# EAGLE design Schematic (EAGLE 7.7.0)
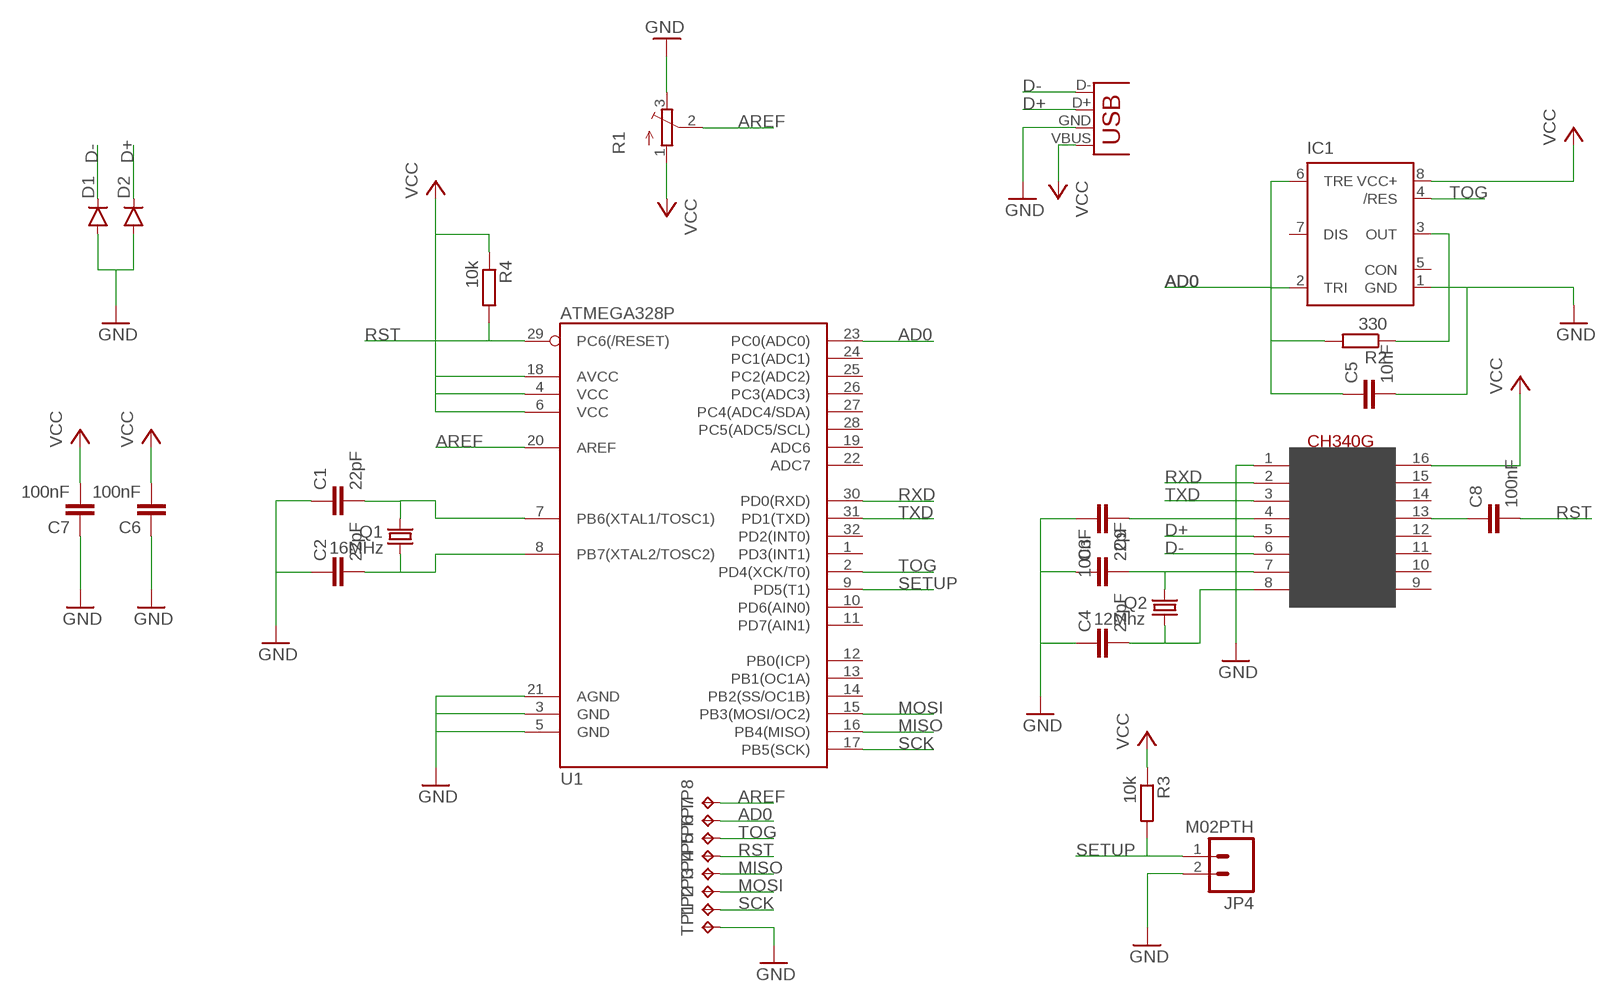
[diagram p0: schematic, sheet 1]

## Parts
C1  22pF  C-EUC0603K  [C0603K]
C2  22pF  C-EUC0603K  [C0603K]
C3  22pF  C-EUC0603K  [C0603K]
C4  22pF  C-EUC0603K  [C0603K]
C5  10nF  C-EUC0603K  [C0603K]
C6  100nF  C-EUC0603K  [C0603K]
C7  100nF  C-EUC0603K  [C0603K]
C8  100nF  C-EUC0603K  [C0603K]
C9  100nF  C-EUC0603K  [C0603K]
D1  DIODESOD523  [SOD523]
D2  DIODESOD523  [SOD523]
IC1  NE555D  [SO08]
JP1  USB-A-H  [USB-A-H]
JP4  M02PTH  [1X02]
Q1  16MHz  MT-OSCILLATOR  [MT]
Q2  12Mhz  MT-OSCILLATOR  [MT]
R1  TRIM_EU-3223W  [3223W]
R2  330  R-EU_R0603  [R0603]
R3  10k  R-EU_R0603  [R0603]
R4  10k  R-EU_R0603  [R0603]
TP1  TPTP10R  [TP10R]
TP2  TPTP10R  [TP10R]
TP3  TPTP10R  [TP10R]
TP4  TPTP10R  [TP10R]
TP5  TPTP10R  [TP10R]
TP6  TPTP10R  [TP10R]
TP7  TPTP10R  [TP10R]
TP8  TPTP10R  [TP10R]
U1  ATMEGA328P  ATMEGA328_SMT  [TQFP32-08]
U2  CH340G  [SOIC16]

## Nets
AD0: C5.1 IC1.2(TRI) IC1.6(TRE) R2.2 TP7.TP U1.23(PC0(ADC0))
AREF: R1.2(S) TP8.TP U1.20(AREF)
D+: D2.C JP1.D+(D-) U2.5(D+)
D-: D1.C JP1.D-(D+) U2.6(D-)
GND: C1.1 C2.1 C3.1 C4.1 C5.2 C6.1 C7.1 C9.2 D1.A D2.A IC1.1(GND) JP1.GND(VBUS) JP4.2 R1.3(E) TP1.TP U1.3(GND) U1.5(GND) U1.21(AGND) U2.1(GND)
MISO: TP4.TP U1.16(PB4(MISO))
MOSI: TP3.TP U1.15(PB3(MOSI/OC2))
N$1: IC1.3(OUT) R2.1
N$2: C3.2 Q2.3 U2.7(XI)
N$3: C4.2 Q2.1 U2.8(XO)
N$4: C1.2 Q1.3 U1.7(PB6(XTAL1/TOSC1))
N$5: C2.2 Q1.1 U1.8(PB7(XTAL2/TOSC2))
N$6: C8.1 U2.13(DTR)
N$7: C9.1 U2.4(V3)
RST: C8.2 R4.2 TP5.TP U1.29(PC6(/RESET))
RXD: U1.30(PD0(RXD)) U2.2(TX)
SCK: TP2.TP U1.17(PB5(SCK))
SETUP: JP4.1 R3.2 U1.9(PD5(T1))
TOG: IC1.4(/RES) TP6.TP U1.2(PD4(XCK/T0))
TXD: U1.31(PD1(TXD)) U2.3(RX)
VCC: C6.2 C7.2 IC1.8(VCC+) JP1.VBUS(GND) R1.1(A) R3.1 R4.1 U1.4(VCC) U1.6(VCC) U1.18(AVCC) U2.16(VCC)
Unconnected: IC1.5(CON) IC1.7(DIS) U1.1(PD3(INT1)) U1.10(PD6(AIN0)) U1.11(PD7(AIN1)) U1.12(PB0(ICP)) U1.13(PB1(OC1A)) U1.14(PB2(SS/OC1B)) U1.19(ADC6) U1.22(ADC7) U1.24(PC1(ADC1)) U1.25(PC2(ADC2)) U1.26(PC3(ADC3)) U1.27(PC4(ADC4/SDA)) U1.28(PC5(ADC5/SCL)) U1.32(PD2(INT0)) U2.9(CTS) U2.10(DSR) U2.11(RI) U2.12(DCD) U2.14(RTS) U2.15(RS232)

## Library data of the parts
C1-C9 = rcl:C-EU: CAPACITOR, European symbol
D1 D2 = SparkFun-DiscreteSemi:DIODE: Diode These are standard reverse protection diodes and small signal diodes. SMA package can handle up to about 1A. SOD-323 can handle about 200mA. What the SOD-323 package when ordering, there are some mfgs out there that are 5-pin packages.
IC1 = SparkFun-AnalogIC:NE555: General purpose bipolar Timer
JP1 = SparkFun-Connectors:USB: USB Connectors USB-B-PTH is fully proven SKU : PRT-00139/CONN-08278 USB-miniB is fully proven SKU : PRT-00587 USB-A-PCB is untested. USB-A-H is throughly reviewed, but untested. Spark Fun Electronics SKU : PRT-00437 USB-B-SMT is throughly reviewed, but untested. Needs silkscreen touching up. USB-A-S has not been used/tested USB-MB-H has not been used/tested USB-MICROB has been used. CONN-09505
JP4 = SparkFun-Connectors:M02: Standard 2-pin 0.1" header. Use with - straight break away headers ( PRT-00116) - right angle break away headers (PRT-00553) - swiss pins (PRT-00743) - machine pins (PRT-00117) - female headers (PRT-00115) Molex polarized connector foot print use with: PRT-08233 with associated crimp pins and housings. 2.54_SCREWTERM for use with PRT-10571. 3.5mm Screw Terminal footprints for PRT-08084 5mm Screw Terminal footprints for use with PRT-08432
Q1 Q2 = seb:MT-OSCILLATOR
R1 = pot:TRIM_EU-: POTENTIOMETER
R2-R4 = rcl:R-EU_: RESISTOR, European symbol
TP1-TP8 = testpad:TP: Test pad
U1 = SparkFun-DigitalIC:ATMEGA328_SMT: 32-Pin Atmega328 part Commonly used on Arduino compatible boards Available in QFP and QFN packages TQFP is IC-09069 QFN is non-stock; PROD_ID: IC-09069
U2 = usb-serial:CH340G

## Board
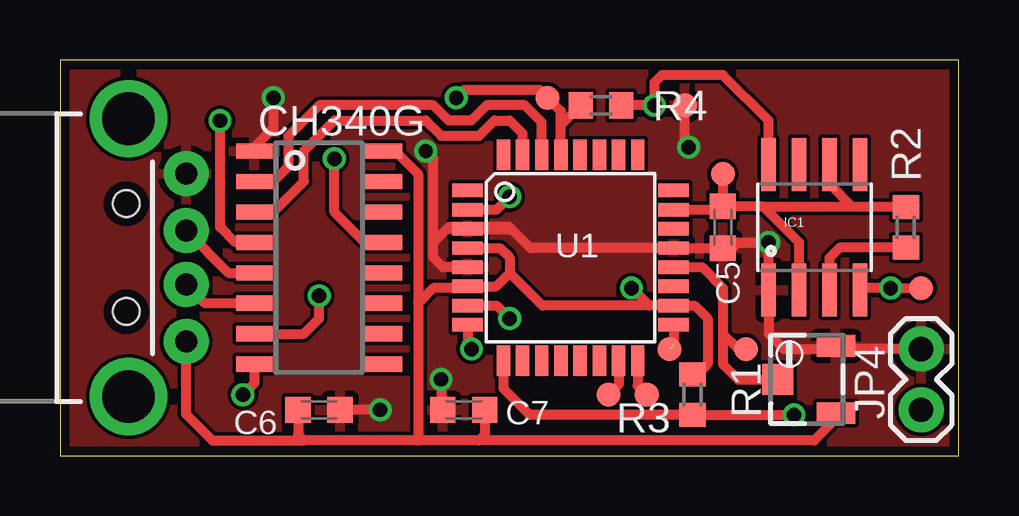
[diagram p1: board, top side]
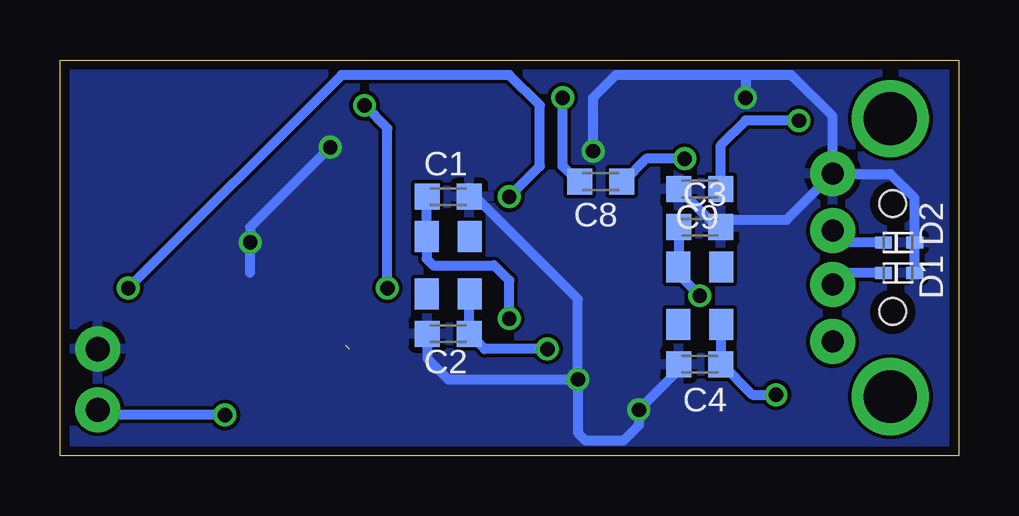
[diagram p2: board, bottom side, seen from below]

Size 37.45 x 16.5 mm. Coordinates in mm from the lower left corner, seen from the top.
Outline: 0,0 37.45,0 37.45,16.5 0,16.5 0,0
Copper layers (1*16): Top 0.0356mm / dielectric 1.5011mm / Bottom 0.0356mm
Design rules "LaenPCBOrder": minimum track width 6mil, minimum drill 13mil, track to track 6mil, track to pad 6mil, pad to pad 6mil, via to via 6mil, smd to smd 6mil, copper to edge 15mil, drill to drill 6mil, minimum pad ring 7mil, minimum via ring 7mil, stop-mask expansion 4mil, vias tented up to drill 0mil, thermal gap 10mil

### Footprints (pad centres in the part's own frame; a part is rotated, then mirrored left to right if it is on the bottom)
C0603K = smd 1.05 x 1.08: 1 -0.875,0; 2 0.875,0
SOD523 = smd 0.7 x 0.5: A 0.7,0; C -0.6,0
SO08 = smd 0.61 x 2.21: 1 -1.905,-2.616; 2 -0.635,-2.616; 3 0.635,-2.616; 4 1.905,-2.616; 5 1.905,2.616; 6 0.635,2.616; 7 -0.635,2.616; 8 -1.905,2.616
USB-A-H = drill 0.914 pad 1.88: D+ 2.4,1.127; D- 2.4,-1.127; GND 2.4,3.5; VBUS 2.4,-3.5 | drill 2.2: GND2 0,-5.8; GND3 0,5.8 | hole 1.1: -0.1,2.25; -0.1,-2.25
1X02 = drill 1.016 pad 1.88: 1 0,0; 2 2.54,0
MT = smd 1.3 x 1: 1 1.2,0.9; 2 -1.2,0.9; 3 -1.2,-0.9; 4 1.2,-0.9
3223W = smd 0.9 x 1.6: 1 -1.4,-1.215; 3 1.4,-1.215 | smd 1.3 x 1.3: 2 0,1.215
R0603 = smd 1 x 1.1: 1 -0.85,0; 2 0.85,0
TP10R = smd 1 x 1: TP 0,0
TQFP32-08 = smd 1.27 x 0.559: 1 -4.293,2.8; 2 -4.293,2; 3 -4.293,1.2; 4 -4.293,0.4; 5 -4.293,-0.4; 6 -4.293,-1.2; 7 -4.293,-2; 8 -4.293,-2.8; 17 4.293,-2.8; 18 4.293,-2; 19 4.293,-1.2; 20 4.293,-0.4; 21 4.293,0.4; 22 4.293,1.2; 23 4.293,2; 24 4.293,2.8 | smd 0.559 x 1.27: 9 -2.8,-4.293; 10 -2,-4.293; 11 -1.2,-4.293; 12 -0.4,-4.293; 13 0.4,-4.293; 14 1.2,-4.293; 15 2,-4.293; 16 2.8,-4.293; 25 2.8,4.293; 26 2,4.293; 27 1.2,4.293; 28 0.4,4.293; 29 -0.4,4.293; 30 -1.2,4.293; 31 -2,4.293; 32 -2.8,4.293
SOIC16 = smd 0.635 x 1.524: 1 -4.445,-2.695; 2 -3.175,-2.695; 3 -1.905,-2.695; 4 -0.635,-2.695; 5 0.635,-2.695; 6 1.905,-2.695; 7 3.175,-2.695; 8 4.445,-2.695; 9 4.445,2.695; 10 3.175,2.695; 11 1.905,2.695; 12 0.635,2.695; 13 -0.635,2.695; 14 -1.905,2.695; 15 -3.175,2.695; 16 -4.445,2.695

### Placement (x,y rotation side)
C1  21.27,10.79 180 bottom
C2  21.27,5.08 0 bottom
C3  10.79,9.53 180 bottom
C4  10.79,3.81 0 bottom
C5  27.62,9.53 270 top
C6  10.79,1.91 180 top
C7  16.83,1.91 0 top
C8  14.92,11.43 180 bottom
C9  10.79,11.11 180 bottom
D1  2.54,7.62 0 bottom
D2  2.54,8.89 0 bottom
IC1  31.43,9.53 0 top
JP1  2.86,8.26 0 top
JP4  35.88,1.91 90 top
Q1  21.27,7.94 270 bottom
Q2  10.79,6.67 270 bottom
R1  31.11,3.17 90 top
R2  35.24,9.53 90 top
R3  26.35,2.54 270 top
R4  22.54,14.61 180 top
TP1  26.04,14.61 0 top
TP2  25.4,4.45 0 top
TP3  22.86,2.54 0 top
TP4  24.45,2.54 0 top
TP5  20.32,14.92 0 top
TP6  35.88,6.99 0 top
TP7  27.62,11.75 0 top
TP8  28.57,4.45 0 top
U1  21.27,8.26 0 top
U2  10.79,8.26 270 top

### Tracks (layer width: path | path; a pad name or v marks a point on that pad's centre or on a via)
AD0
  Top 0.406: IC1.2 30.8,8.89 29.37,10.32 | R2.2 33.02,10.38 | 33.02,10.38 29.43,10.38 29.37,10.32 | U1.23 27.48,10.26 C5.1 | C5.1 29.29,10.4 29.37,10.32 | TP7.TP C5.1 | IC1.6 32.07,11.33 33.02,10.38
AREF
  Top 0.406: U1.20 26.75,7.86 27.62,6.99 27.62,5.08 | 27.62,5.08 27.62,3.81 28.26,3.17 R1.2 | TP8.TP 28.26,4.45 27.62,5.08
D+
  Top 0.406: U2.5 7.02,7.62 JP1.D+
  Bottom 0.406: D2.C 4.77,8.89 JP1.D+
D-
  Top 0.406: U2.6 6.04,6.35 JP1.D-
  Bottom 0.406: D1.C 4.77,7.62 JP1.D-
GND  (via drill 0.6)
  Top 0.406: U1.5 15.96,7.86 15.56,8.26 15.56,8.89 | 16.12,9.46 U1.3 18.8,9.46 | 16.12,9.46 15.56,8.89 | U1.21 19.6,8.65 18.8,9.46 | v13.34,1.91 C6.1 | JP4.2 32.78,4.45 R1.3 32.52,4.45 30.16,4.45 29.53,5.08 IC1.1 v29.53,8.89 28.26,8.89 28.02,8.65 C5.2 U1.21 | U1.21 27.22,8.65 | 18.8,9.46 18.73,9.53 16.19,9.53 16.12,9.46 | 15.56,8.89 15.56,12.38 v15.24,12.7 | v15.88,3.17 15.88,1.98 C7.1 | U2.1 8.1,12.86 8.89,13.65 v8.89,14.92 | v26.19,12.86 26.04,13.02 TP1.TP
  Bottom 0.406: 26.11,12.94 v26.19,12.86 29.53,9.53 v29.53,8.89 29.53,7.62 | D1.A D2.A 1.84,10.73 2.86,11.75 5.25,11.75 JP1.GND | v15.24,12.7 15.24,14.92 14.29,15.88 8.89,15.88 | v15.88,3.17 15.88,0.95 15.56,0.64 13.97,0.64 13.34,1.27 v13.34,1.91 11.67,3.57 C4.1 | JP1.GND 5.26,14.15 6.99,15.88 8.89,15.88 | C9.2 10.08,9.53 C3.1 10.16,9.84 7.17,9.84 JP1.GND | 8.89,15.88 v8.89,14.92 | C1.1 20.14,10.79 15.88,6.53 v15.88,3.17 | C2.1 22.15,4.05 21.27,3.17 v15.88,3.17
  pour Top: 0,16.51 37.78,16.51 37.78,0 0,0
  pour Bottom: 0,16.51 37.78,16.51 37.78,0 0,0
MISO
  Top 0.406: U1.16 24.07,2.92 TP4.TP
MOSI
  Top 0.406: U1.15 23.27,2.95 TP3.TP
N$1
  Top 0.406: IC1.3 32.07,8.26 32.49,8.68 R2.1
N$2  (via drill 0.6)
  Top 0.406: U2.7 10.16,5.08 10.79,5.71 v10.79,6.67
  Bottom 0.406: C3.2 11.67,7.89 Q2.3 11.7,7.57 v10.79,6.67
N$3  (via drill 0.6)
  Top 0.406: U2.8 8.1,3.02 v7.62,2.54
  Bottom 0.406: C4.2 9.89,3.83 | 9.89,3.83 Q2.1 | 9.89,3.83 8.6,2.54 v7.62,2.54
N$4  (via drill 0.6)
  Top 0.406: U1.7 18.19,6.25 v18.73,5.71
  Bottom 0.406: v18.73,5.71 18.73,7.3 19.37,7.94 21.91,7.94 22.17,8.2 Q1.3 22.17,10.77 C1.2
N$5  (via drill 0.6)
  Top 0.406: U1.8 16.98,4.61 v17.14,4.45
  Bottom 0.406: v17.14,4.45 19.76,4.45 C2.2 20.4,6.71 Q1.1
N$6  (via drill 0.6)
  Top 0.406: U2.13 12.7,8.89 11.43,10.16 v11.43,12.38
  Bottom 0.406: v11.43,12.38 13.02,12.38 13.97,11.43 13.97,11.51 C8.1
N$7  (via drill 0.6)
  Top 0.406: 7.62,8.89 U2.4 7.3,8.89 6.67,9.53 v6.67,13.97
  Bottom 0.406: v6.67,13.97 8.89,13.97 9.92,12.94 C9.1
RST  (via drill 0.6)
  Top 0.406: U1.29 20.87,13.79 | 20.87,13.79 R4.2 | 20.87,13.79 20.87,14.37 TP5.TP 20,15.24 16.83,15.24 v16.51,14.92
  Bottom 0.406: C8.2 15.88,11.43 16.51,12.06 v16.51,14.92
RXD
  Top 0.406: U2.2 8.89,11.43 9.53,12.06 9.53,13.34 10.79,14.61 15.56,14.61 16.19,13.97 17.14,13.97 17.78,14.61 19.37,14.61 20.07,13.9 U1.30
SCK  (1 unrouted)
  Top 0.406: U1.17 25.57,4.61
SETUP  (via drill 0.6)
  Top 0.406: v30.58,1.69 R3.2 19.58,1.69 18.47,2.8 U1.9
  Bottom 0.406: v30.58,1.69 35.66,1.69 JP4.1
TOG  (via drill 0.6)
  Top 0.406: U1.2 18.19,10.26 v18.73,10.79 | IC1.4 33.41,6.99 v34.61,6.99 TP6.TP
  Bottom 0.406: v34.61,6.99 25.72,15.88 18.73,15.88 17.46,14.61 17.46,12.06 v18.73,10.79
TXD
  Top 0.406: U2.3 8.89,10.16 10.16,11.43 10.16,12.7 11.43,13.97 15.24,13.97 15.88,13.34 17.46,13.34 18.1,13.97 18.73,13.97 19.27,13.43 U1.31
VCC  (via drill 0.6)
  Top 0.406: 18.73,7.62 18.17,7.05 U1.6 16.91,6.99 15.56,6.99 14.92,6.35 | U1.4 18.33,8.65 18.73,8.26 18.73,7.62 | U1.18 20.1,6.25 18.73,7.62 | 14.92,6.35 14.92,11.75 13.97,12.7 U2.16 | 14.92,6.35 14.92,0.64 | U1.18 26.45,6.25 26.99,5.71 26.99,3.81 26.57,3.39 R3.1 | R1.1 32.57,1.77 31.43,0.64 17.46,0.64 | 17.46,0.64 14.92,0.64 | 14.92,0.64 10.16,0.64 | C7.2 17.7,0.88 17.46,0.64 | C6.2 9.92,0.88 10.16,0.64 | 10.16,0.64 6.35,0.64 5.26,1.73 JP1.VBUS | IC1.8 29.53,12.06 | 29.53,12.38 IC1.8 | U1.18 24.54,6.25 v23.81,6.99 | R4.1 v24.77,14.61 24.77,15.56 25.08,15.88 27.62,15.88 29.53,13.97 IC1.8
  Bottom 0.406: v23.81,6.99 23.81,13.65 v24.77,14.61